# EAGLE design BinaryClock (EAGLE 6.5.0)
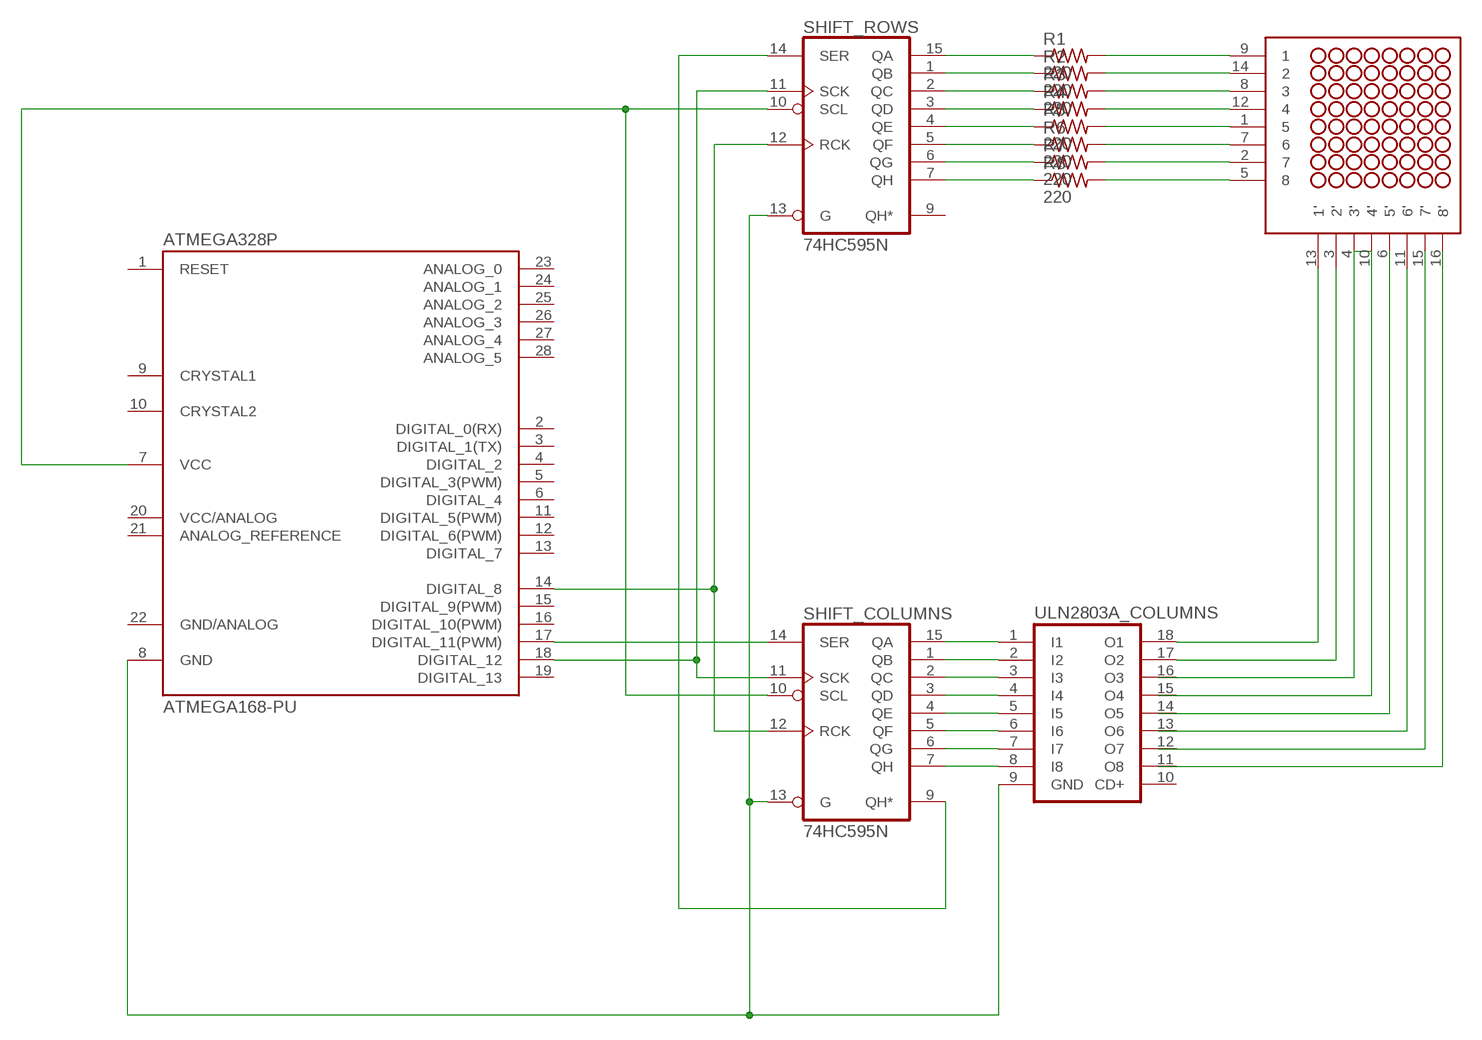
[diagram p0: schematic, sheet 1]

## Parts
ATMEGA328P  ATMEGA168-PU  [DIL28-3]
LD1088BS  NFM-12881BG-11  [NFM-12881BG-11]
R1  220  R-US_0207/10  [0207/10]
R2  220  R-US_0207/10  [0207/10]
R3  220  R-US_0207/10  [0207/10]
R4  R-US_0207/10  [0207/10]
R5  220  R-US_0207/10  [0207/10]
R6  220  R-US_0207/10  [0207/10]
R7  220  R-US_0207/10  [0207/10]
R8  220  R-US_0207/10  [0207/10]
SHIFT_COLUMNS  74HC595N  [DIL16]
SHIFT_ROWS  74HC595N  [DIL16]
ULN2803A_COLUMNS  ULN2803A  [DIL18]

## Nets
N$1: SHIFT_COLUMNS.9(QH*) SHIFT_ROWS.14(SER)
N$2: ATMEGA328P.17(DIGITAL_11(PWM)) SHIFT_COLUMNS.14(SER)
N$3: ATMEGA328P.18(DIGITAL_12) SHIFT_COLUMNS.11(SCK) SHIFT_ROWS.11(SCK)
N$4: ATMEGA328P.14(DIGITAL_8) SHIFT_COLUMNS.12(RCK) SHIFT_ROWS.12(RCK)
N$5: LD1088BS.14 R2.2
N$6: SHIFT_COLUMNS.15(QA) ULN2803A_COLUMNS.1(I1)
N$7: SHIFT_COLUMNS.1(QB) ULN2803A_COLUMNS.2(I2)
N$8: SHIFT_COLUMNS.2(QC) ULN2803A_COLUMNS.3(I3)
N$9: SHIFT_COLUMNS.3(QD) ULN2803A_COLUMNS.4(I4)
N$10: SHIFT_COLUMNS.4(QE) ULN2803A_COLUMNS.5(I5)
N$11: SHIFT_COLUMNS.5(QF) ULN2803A_COLUMNS.6(I6)
N$12: SHIFT_COLUMNS.6(QG) ULN2803A_COLUMNS.7(I7)
N$13: SHIFT_COLUMNS.7(QH) ULN2803A_COLUMNS.8(I8)
N$14: ATMEGA328P.7(VCC) SHIFT_COLUMNS.10(SCL) SHIFT_ROWS.10(SCL)
N$15: R2.1 SHIFT_ROWS.1(QB)
N$16: R3.1 SHIFT_ROWS.2(QC)
N$17: R4.1 SHIFT_ROWS.3(QD)
N$18: R5.1 SHIFT_ROWS.4(QE)
N$19: R6.1 SHIFT_ROWS.5(QF)
N$20: R7.1 SHIFT_ROWS.6(QG)
N$21: R8.1 SHIFT_ROWS.7(QH)
N$22: R1.1 SHIFT_ROWS.15(QA)
N$23: ATMEGA328P.8(GND) SHIFT_COLUMNS.13(G) SHIFT_ROWS.13(G) ULN2803A_COLUMNS.9(GND)
N$24: LD1088BS.8 R3.2
N$25: LD1088BS.12 R4.2
N$26: LD1088BS.1 R5.2
N$27: LD1088BS.7 R6.2
N$28: LD1088BS.2 R7.2
N$29: LD1088BS.5 R8.2
N$30: LD1088BS.9 R1.2
N$31: LD1088BS.13(1') ULN2803A_COLUMNS.18(O1)
N$32: LD1088BS.3(2') ULN2803A_COLUMNS.17(O2)
N$35: LD1088BS.11(6')
Unconnected: ATMEGA328P.1(RESET) ATMEGA328P.2(DIGITAL_0(RX)) ATMEGA328P.3(DIGITAL_1(TX)) ATMEGA328P.4(DIGITAL_2) ATMEGA328P.5(DIGITAL_3(PWM)) ATMEGA328P.6(DIGITAL_4) ATMEGA328P.9(CRYSTAL1) ATMEGA328P.10(CRYSTAL2) ATMEGA328P.11(DIGITAL_5(PWM)) ATMEGA328P.12(DIGITAL_6(PWM)) ATMEGA328P.13(DIGITAL_7) ATMEGA328P.15(DIGITAL_9(PWM)) ATMEGA328P.16(DIGITAL_10(PWM)) ATMEGA328P.19(DIGITAL_13) ATMEGA328P.20(VCC/ANALOG) ATMEGA328P.21(ANALOG_REFERENCE) ATMEGA328P.23(ANALOG_0) ATMEGA328P.24(ANALOG_1) ATMEGA328P.25(ANALOG_2) ATMEGA328P.26(ANALOG_3) ATMEGA328P.27(ANALOG_4) ATMEGA328P.28(ANALOG_5) LD1088BS.4(3') LD1088BS.6(5') LD1088BS.10(4') LD1088BS.15(7') LD1088BS.16(8') SHIFT_ROWS.9(QH*) ULN2803A_COLUMNS.10(CD+) ULN2803A_COLUMNS.11(O8) ULN2803A_COLUMNS.12(O7) ULN2803A_COLUMNS.13(O6) ULN2803A_COLUMNS.14(O5) ULN2803A_COLUMNS.15(O4) ULN2803A_COLUMNS.16(O3)

## Power pins joined to a net without a drawn wire
GND: SHIFT_COLUMNS.8(GND) SHIFT_ROWS.8(GND)
GND/ANALOG: ATMEGA328P.22(GND/ANALOG)
VCC: SHIFT_COLUMNS.16(VCC) SHIFT_ROWS.16(VCC)

## Library data of the parts
ATMEGA328P = Arduino-AVR:ATMEGA168-PU
LD1088BS = eagle-library-edeca.net-v5:NFM-12881BG-11: Futurlec 8x8 LED Matrix
R1-R8 = resistor:R-US_: RESISTOR, American symbol
SHIFT_COLUMNS SHIFT_ROWS = 74xx-eu:74*595: 8-bit SHIFT REGISTER, output latch
ULN2803A_COLUMNS = uln-udn:ULN2803A: DRIVER ARRAY

## Board
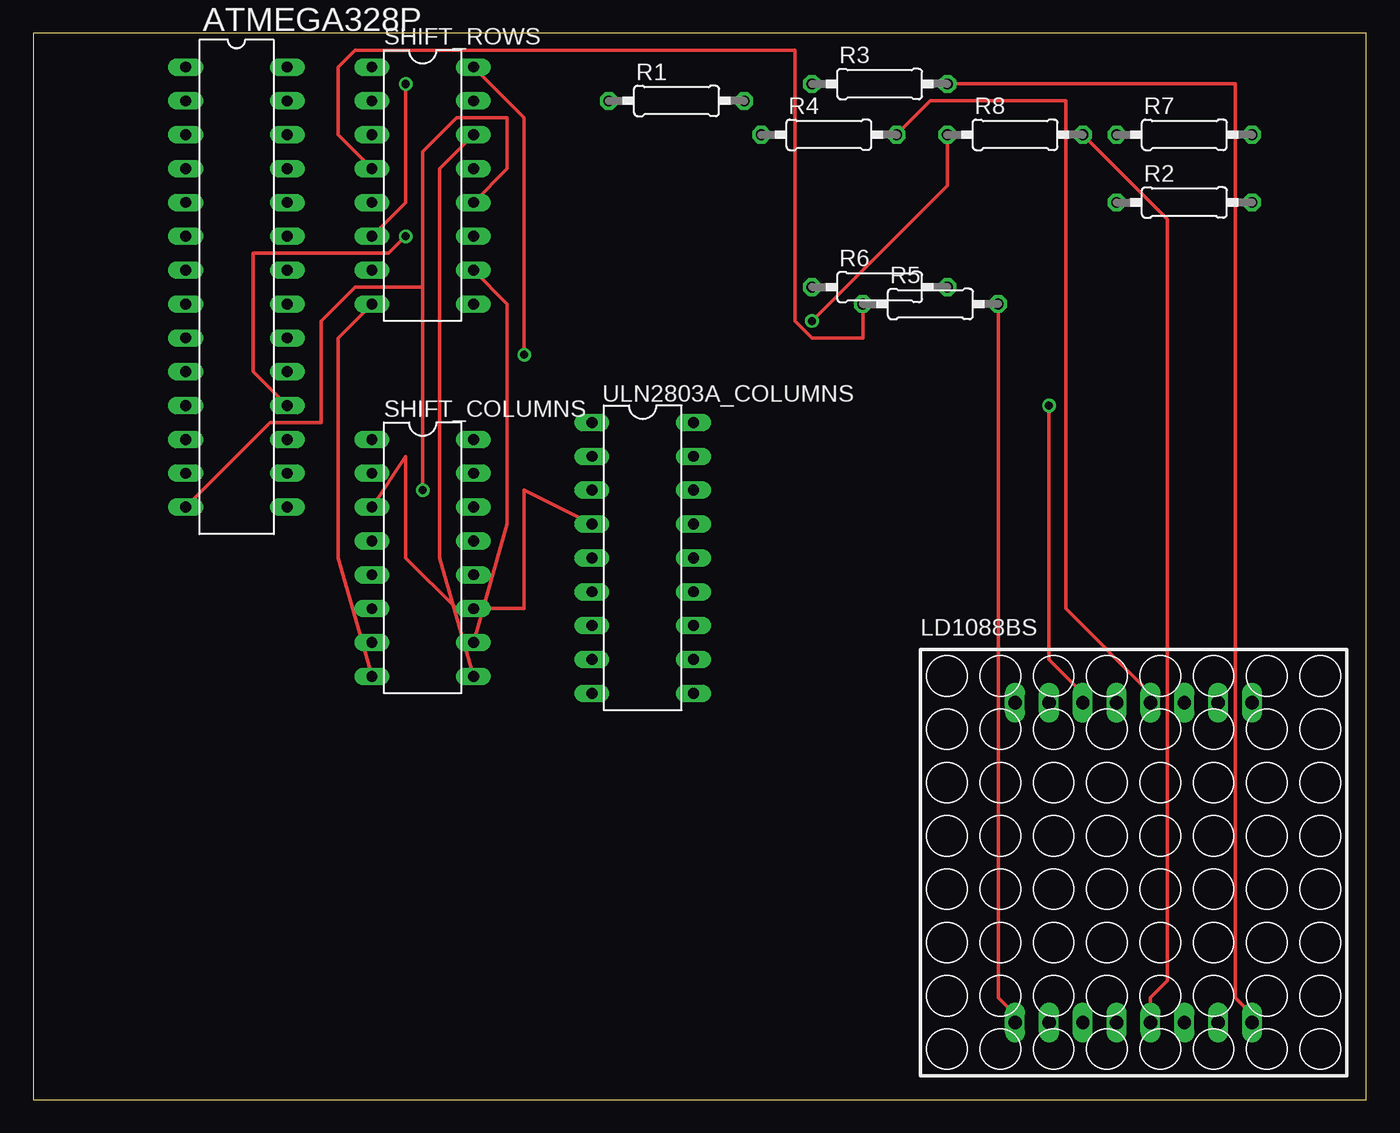
[diagram p1: board, top side]
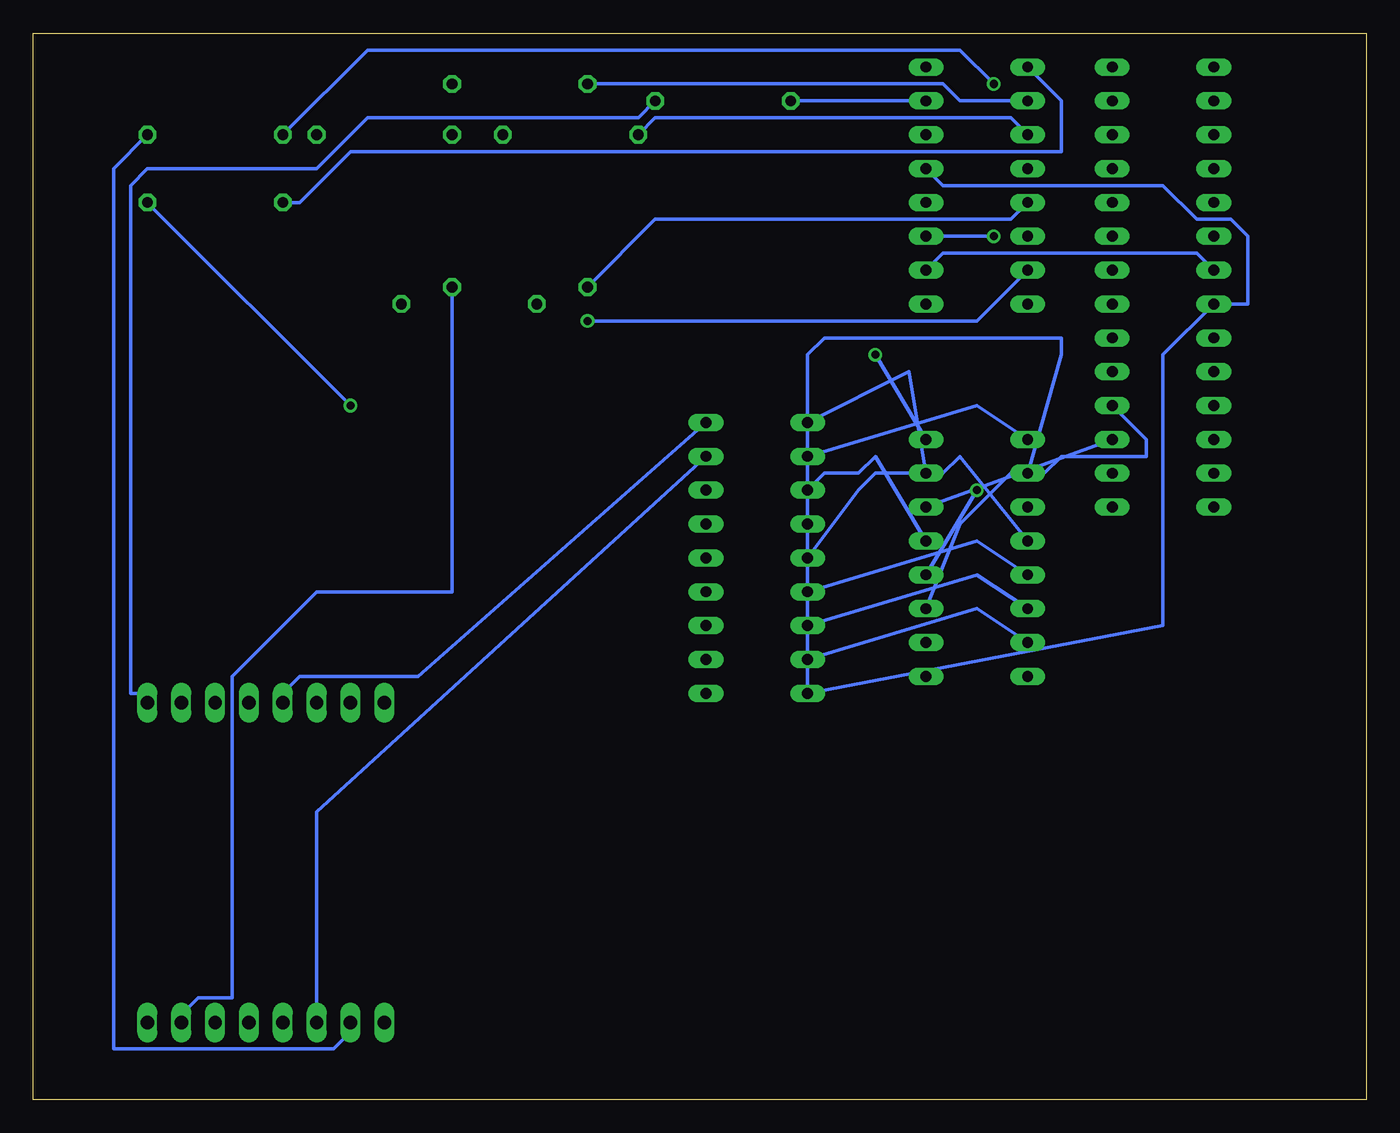
[diagram p2: board, bottom side, seen from below]

Size 100 x 80 mm. Coordinates in mm from the lower left corner, seen from the top.
Outline: 0,0 100,0 100,80 0,80 0,0
Copper layers (1*16): Top 0.035mm / dielectric 1.5mm / Bottom 0.035mm
Design rules "default": minimum track width 10mil, minimum drill 24mil, track to track 8mil, track to pad 8mil, pad to pad 8mil, via to via 8mil, smd to smd 8mil, copper to edge 40mil, drill to drill 8mil, minimum pad ring 10mil, minimum via ring 8mil, stop-mask expansion 4mil, vias tented up to drill 0mil, thermal gap 10mil

### Footprints (pad centres in the part's own frame; a part is rotated, then mirrored left to right if it is on the bottom)
DIL28-3 = drill 0.813 long: 1 -16.51,-3.81; 2 -13.97,-3.81; 3 -11.43,-3.81; 4 -8.89,-3.81; 5 -6.35,-3.81; 6 -3.81,-3.81; 7 -1.27,-3.81; 8 1.27,-3.81; 9 3.81,-3.81; 10 6.35,-3.81; 11 8.89,-3.81; 12 11.43,-3.81; 13 13.97,-3.81; 14 16.51,-3.81; 15 16.51,3.81; 16 13.97,3.81; 17 11.43,3.81; 18 8.89,3.81; 19 6.35,3.81; 20 3.81,3.81; 21 1.27,3.81; 22 -1.27,3.81; 23 -3.81,3.81; 24 -6.35,3.81; 25 -8.89,3.81; 26 -11.43,3.81; 27 -13.97,3.81; 28 -16.51,3.81
NFM-12881BG-11 = drill 1 long: 1 -8.89,-12; 2 -6.35,-12; 3 -3.81,-12; 4 -1.27,-12; 5 1.27,-12; 6 3.81,-12; 7 6.35,-12; 8 8.89,-12; 9 8.89,12; 10 6.35,12; 11 3.81,12; 12 1.27,12; 13 -1.27,12; 14 -3.81,12; 15 -6.35,12; 16 -8.89,12
0207/10 = drill 0.813 octagon: 1 -5.08,0; 2 5.08,0
DIL16 = drill 0.813 long: 1 -8.89,-3.81; 2 -6.35,-3.81; 3 -3.81,-3.81; 4 -1.27,-3.81; 5 1.27,-3.81; 6 3.81,-3.81; 7 6.35,-3.81; 8 8.89,-3.81; 9 8.89,3.81; 10 6.35,3.81; 11 3.81,3.81; 12 1.27,3.81; 13 -1.27,3.81; 14 -3.81,3.81; 15 -6.35,3.81; 16 -8.89,3.81
DIL18 = drill 0.813 long: 1 -10.16,-3.81; 2 -7.62,-3.81; 3 -5.08,-3.81; 4 -2.54,-3.81; 5 0,-3.81; 6 2.54,-3.81; 7 5.08,-3.81; 8 7.62,-3.81; 9 10.16,-3.81; 10 10.16,3.81; 11 7.62,3.81; 12 5.08,3.81; 13 2.54,3.81; 14 0,3.81; 15 -2.54,3.81; 16 -5.08,3.81; 17 -7.62,3.81; 18 -10.16,3.81

### Placement (x,y rotation side)
ATMEGA328P  15.24,60.96 270 top
LD1088BS  82.55,17.78 0 top
R1  48.26,74.93 0 top
R2  86.36,67.31 0 top
R3  63.5,76.2 0 top
R4  59.69,72.39 0 top
R5  67.31,59.69 0 top
R6  63.5,60.96 0 top
R7  86.36,72.39 0 top
R8  73.66,72.39 0 top
SHIFT_COLUMNS  29.21,40.64 270 top
SHIFT_ROWS  29.21,68.58 270 top
ULN2803A_COLUMNS  45.72,40.64 270 top

### Tracks (layer width: path | path; a pad name or v marks a point on that pad's centre or on a via)
GND
  Top 0.254: SHIFT_COLUMNS.8 22.86,40.64 22.86,57.15 SHIFT_ROWS.8
N$1
  Top 0.254: SHIFT_COLUMNS.9 30.48,40.64 30.48,69.85 SHIFT_ROWS.14
N$2
  Bottom 0.254: SHIFT_COLUMNS.14 ATMEGA328P.17
N$3  (via drill 0.61)
  Top 0.254: v27.94,64.77 26.67,63.5 16.51,63.5 16.51,54.61 ATMEGA328P.18
  Bottom 0.254: ATMEGA328P.18 16.51,49.53 16.51,48.26 22.86,48.26 24.13,46.99 26.67,46.99 30.48,43.18 SHIFT_COLUMNS.11 | v27.94,64.77 SHIFT_ROWS.11
N$4  (via drill 0.61)
  Top 0.254: ATMEGA328P.14 17.78,50.8 21.59,50.8 21.59,58.42 24.13,60.96 29.21,60.96 | 29.21,60.96 29.21,71.12 31.75,73.66 35.56,73.66 35.56,69.85 SHIFT_ROWS.12 | 29.21,60.96 v29.21,45.72
  Bottom 0.254: v29.21,45.72 SHIFT_COLUMNS.12
N$5  (via drill 0.61)
  Top 0.254: v76.2,52.07 76.2,33.02 78.74,30.48 LD1088BS.14
  Bottom 0.254: v76.2,52.07 R2.2
N$6
  Bottom 0.254: SHIFT_COLUMNS.15 34.29,54.61 ULN2803A_COLUMNS.1
N$7
  Bottom 0.254: SHIFT_COLUMNS.1 29.21,52.07 ULN2803A_COLUMNS.2
N$8
  Bottom 0.254: SHIFT_COLUMNS.2 22.86,55.88 22.86,57.15 40.64,57.15 41.91,55.88 ULN2803A_COLUMNS.3
N$9
  Top 0.254: SHIFT_COLUMNS.3 27.94,48.26 27.94,40.64 31.75,36.83 36.83,36.83 36.83,45.72 ULN2803A_COLUMNS.4
N$10
  Bottom 0.254: SHIFT_COLUMNS.4 30.48,48.26 31.75,46.99 36.83,46.99 38.1,45.72 ULN2803A_COLUMNS.5
N$11
  Bottom 0.254: SHIFT_COLUMNS.5 29.21,41.91 ULN2803A_COLUMNS.6
N$12
  Bottom 0.254: SHIFT_COLUMNS.6 29.21,39.37 ULN2803A_COLUMNS.7
N$13
  Bottom 0.254: SHIFT_COLUMNS.7 29.21,36.83 ULN2803A_COLUMNS.8
N$14
  Top 0.254: SHIFT_COLUMNS.10 35.56,43.18 35.56,59.69 SHIFT_ROWS.10
  Bottom 0.254: ATMEGA328P.7 12.7,63.5 31.75,63.5 SHIFT_ROWS.10
N$15
  Bottom 0.254: SHIFT_ROWS.1 22.86,74.93 22.86,71.12 76.2,71.12 80.01,67.31 R2.1
N$16
  Bottom 0.254: SHIFT_ROWS.2 30.48,74.93 31.75,76.2 R3.1
N$17
  Bottom 0.254: SHIFT_ROWS.3 26.67,73.66 53.34,73.66 R4.1
N$18
  Top 0.254: SHIFT_ROWS.4 22.86,72.39 22.86,77.47 24.13,78.74 57.15,78.74 57.15,58.42 58.42,57.15 62.23,57.15 R5.1
N$19
  Bottom 0.254: SHIFT_ROWS.5 26.67,66.04 53.34,66.04 R6.1
N$20  (via drill 0.61)
  Top 0.254: SHIFT_ROWS.6 27.94,67.31 v27.94,76.2
  Bottom 0.254: v27.94,76.2 30.48,78.74 74.93,78.74 R7.1
N$21  (via drill 0.61)
  Top 0.254: v58.42,58.42 68.58,68.58 R8.1
  Bottom 0.254: SHIFT_ROWS.7 29.21,58.42 v58.42,58.42
N$22
  Bottom 0.254: R1.1 SHIFT_ROWS.15
N$23
  Bottom 0.254: SHIFT_COLUMNS.13 36.83,48.26 38.1,46.99 40.64,46.99 41.91,45.72 ULN2803A_COLUMNS.9 15.24,35.56 15.24,55.88 ATMEGA328P.8 8.89,59.69 8.89,64.77 10.16,66.04 12.7,66.04 15.24,68.58 31.75,68.58 SHIFT_ROWS.13
N$24
  Top 0.254: R3.2 90.17,76.2 90.17,7.62 91.44,6.35 LD1088BS.8
N$25
  Top 0.254: R4.2 67.31,74.93 77.47,74.93 77.47,36.83 83.82,30.48 LD1088BS.12
N$26
  Top 0.254: R5.2 72.39,7.62 73.66,6.35 LD1088BS.1
N$27
  Bottom 0.254: R6.2 68.58,38.1 78.74,38.1 85.09,31.75 85.09,7.62 87.63,7.62 88.9,6.35 LD1088BS.7
N$28
  Bottom 0.254: R7.2 93.98,69.85 93.98,3.81 77.47,3.81 76.2,5.08 LD1088BS.2
N$29
  Top 0.254: R8.2 85.09,66.04 85.09,8.89 83.82,7.62 LD1088BS.5
N$30
  Bottom 0.254: R1.2 54.61,73.66 74.93,73.66 78.74,69.85 91.44,69.85 92.71,68.58 92.71,30.48 91.44,30.48 LD1088BS.9
N$31
  Bottom 0.254: ULN2803A_COLUMNS.18 71.12,31.75 80.01,31.75 81.28,30.48 LD1088BS.13
N$32
  Bottom 0.254: ULN2803A_COLUMNS.17 78.74,21.59 LD1088BS.3
VCC  (via drill 0.61)
  Top 0.254: v36.83,55.88 36.83,73.66 SHIFT_ROWS.16
  Bottom 0.254: v36.83,55.88 SHIFT_COLUMNS.16